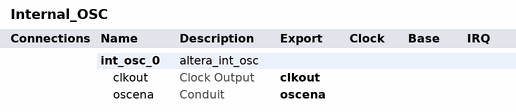
[diagram p0: system contents]
# Platform Designer (Qsys) system Internal_OSC, MAX 10 10M50DAF484C7G
# Parameters at their usual value, and those the tool derives, are not listed.
package require -exact qsys 23.1
create_system Internal_OSC
set_project_property DEVICE_FAMILY {MAX 10}
set_project_property DEVICE 10M50DAF484C7G

add_instance int_osc_0 altera_int_osc 23.1
set_instance_property int_osc_0 AUTO_EXPORT true
set_instance_parameter_value int_osc_0 CBX_AUTO_BLACKBOX ALL
set_instance_parameter_value int_osc_0 CLOCK_FREQUENCY_1 116
set_instance_parameter_value int_osc_0 CLOCK_FREQUENCY_2 77
set_instance_parameter_value int_osc_0 PART_NAME 10M50DAF484C7G

# exported interfaces
add_interface clkout clock source
set_interface_property clkout EXPORT_OF int_osc_0.clkout
add_interface oscena conduit end
set_interface_property oscena EXPORT_OF int_osc_0.oscena

set_interconnect_requirement {$system} qsys_mm.clockCrossingAdapter HANDSHAKE
set_interconnect_requirement {$system} qsys_mm.enableEccProtection FALSE
set_interconnect_requirement {$system} qsys_mm.insertDefaultSlave FALSE
set_interconnect_requirement {$system} qsys_mm.maxAdditionalLatency 1

save_system Internal_OSC.qsys
